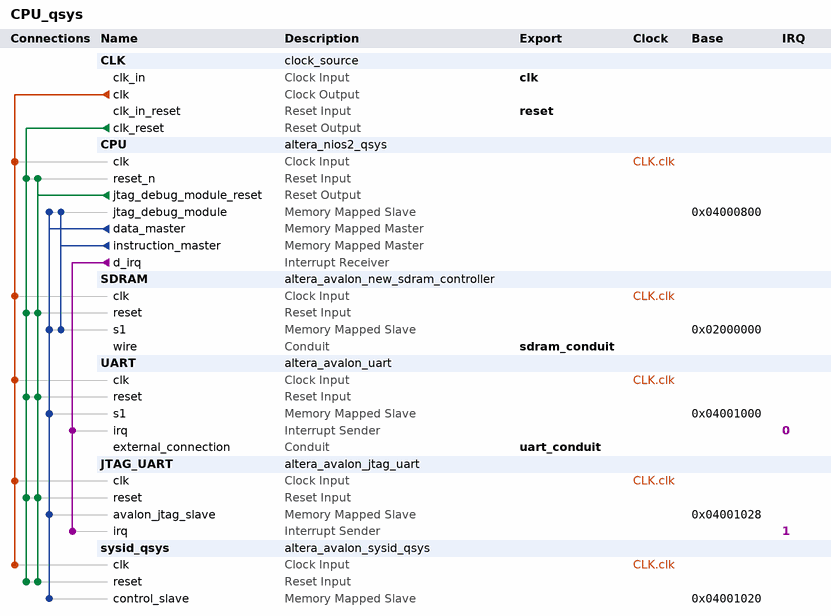
[diagram p0: system contents]
# Platform Designer (Qsys) system CPU_qsys, Cyclone IV E EP4CE10F17C8
# Parameters at their usual value, and those the tool derives, are not listed.
package require -exact qsys 13.1
create_system CPU_qsys
set_project_property DEVICE_FAMILY {Cyclone IV E}
set_project_property DEVICE EP4CE10F17C8

add_instance CLK clock_source 13.1
set_instance_parameter_value CLK clockFrequency 50000000

add_instance CPU altera_nios2_qsys 13.1
set_instance_parameter_value CPU resetSlave SDRAM.s1
set_instance_parameter_value CPU mmu_TLBMissExcSlave None
set_instance_parameter_value CPU exceptionSlave SDRAM.s1
set_instance_parameter_value CPU breakSlave CPU.jtag_debug_module
set_instance_parameter_value CPU impl Fast
set_instance_parameter_value CPU icache_size 4096

add_instance SDRAM altera_avalon_new_sdram_controller 13.1
set_instance_parameter_value SDRAM TAC 5.5
set_instance_parameter_value SDRAM TRCD 20.0
set_instance_parameter_value SDRAM TRP 20.0
set_instance_parameter_value SDRAM casLatency 3
set_instance_parameter_value SDRAM columnWidth 9
set_instance_parameter_value SDRAM dataWidth 16
set_instance_parameter_value SDRAM generateSimulationModel false
set_instance_parameter_value SDRAM model single_Micron_MT48LC4M32B2_7_chip
set_instance_parameter_value SDRAM numberOfBanks 4
set_instance_parameter_value SDRAM numberOfChipSelects 1
set_instance_parameter_value SDRAM powerUpDelay 100.0
set_instance_parameter_value SDRAM refreshPeriod 15.625
set_instance_parameter_value SDRAM rowWidth 13

add_instance UART altera_avalon_uart 13.1
set_instance_parameter_value UART baud 115200
set_instance_parameter_value UART dataBits 8
set_instance_parameter_value UART fixedBaud true
set_instance_parameter_value UART parity NONE
set_instance_parameter_value UART stopBits 1

add_instance JTAG_UART altera_avalon_jtag_uart 13.1
set_instance_parameter_value JTAG_UART simInteractiveOptions NO_INTERACTIVE_WINDOWS

add_instance sysid_qsys altera_avalon_sysid_qsys 13.1
set_instance_parameter_value sysid_qsys id 0

# connections
add_connection CLK.clk CPU.clk clock
add_connection CLK.clk JTAG_UART.clk clock
add_connection CLK.clk SDRAM.clk clock
add_connection CLK.clk sysid_qsys.clk clock
add_connection CLK.clk UART.clk clock
add_connection CLK.clk_reset CPU.reset_n reset
add_connection CLK.clk_reset JTAG_UART.reset reset
add_connection CLK.clk_reset SDRAM.reset reset
add_connection CLK.clk_reset sysid_qsys.reset reset
add_connection CLK.clk_reset UART.reset reset
add_connection CPU.jtag_debug_module_reset CPU.reset_n reset
add_connection CPU.jtag_debug_module_reset JTAG_UART.reset reset
add_connection CPU.jtag_debug_module_reset SDRAM.reset reset
add_connection CPU.jtag_debug_module_reset sysid_qsys.reset reset
add_connection CPU.jtag_debug_module_reset UART.reset reset
add_connection CPU.data_master CPU.jtag_debug_module avalon
set_connection_parameter_value CPU.data_master/CPU.jtag_debug_module baseAddress 0x04000800
add_connection CPU.data_master JTAG_UART.avalon_jtag_slave avalon
set_connection_parameter_value CPU.data_master/JTAG_UART.avalon_jtag_slave baseAddress 0x04001028
add_connection CPU.data_master SDRAM.s1 avalon
set_connection_parameter_value CPU.data_master/SDRAM.s1 baseAddress 0x02000000
add_connection CPU.data_master sysid_qsys.control_slave avalon
set_connection_parameter_value CPU.data_master/sysid_qsys.control_slave baseAddress 0x04001020
add_connection CPU.data_master UART.s1 avalon
set_connection_parameter_value CPU.data_master/UART.s1 baseAddress 0x04001000
add_connection CPU.instruction_master CPU.jtag_debug_module avalon
set_connection_parameter_value CPU.instruction_master/CPU.jtag_debug_module baseAddress 0x04000800
add_connection CPU.instruction_master SDRAM.s1 avalon
set_connection_parameter_value CPU.instruction_master/SDRAM.s1 baseAddress 0x02000000
add_connection CPU.d_irq JTAG_UART.irq interrupt
set_connection_parameter_value CPU.d_irq/JTAG_UART.irq irqNumber 1
add_connection CPU.d_irq UART.irq interrupt
set_connection_parameter_value CPU.d_irq/UART.irq irqNumber 0

# exported interfaces
add_interface clk clock sink
set_interface_property clk EXPORT_OF CLK.clk_in
add_interface reset reset sink
set_interface_property reset EXPORT_OF CLK.clk_in_reset
add_interface sdram_conduit conduit end
set_interface_property sdram_conduit EXPORT_OF SDRAM.wire
add_interface uart_conduit conduit end
set_interface_property uart_conduit EXPORT_OF UART.external_connection

set_interconnect_requirement {$system} qsys_mm.clockCrossingAdapter HANDSHAKE
set_interconnect_requirement {$system} qsys_mm.maxAdditionalLatency 1
set_interconnect_requirement {$system} qsys_mm.insertDefaultSlave false

save_system CPU_qsys.qsys
